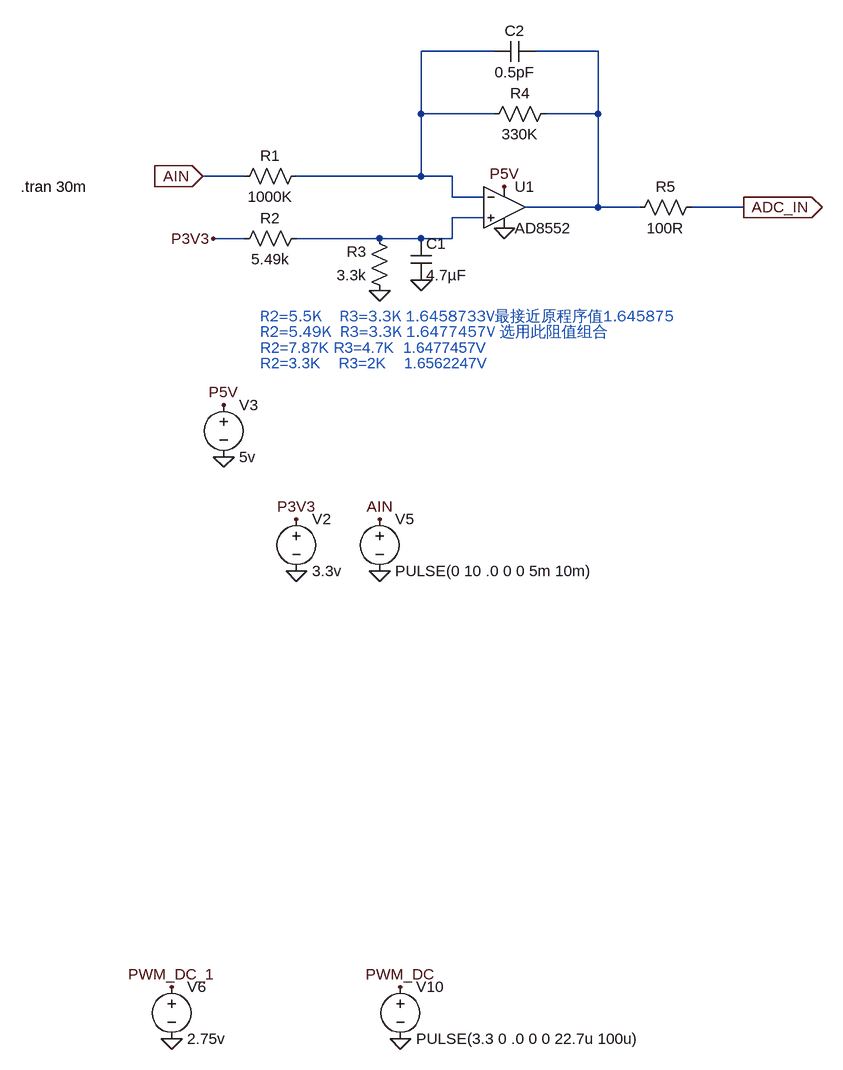
[diagram p0: schematic AD8551_修改为3.3V.asc]
AD8551_修改为3.3V.asc, the LTspice schematic file:
Version 4
SHEET 1 1680 1284
WIRE -608 -256 -720 -256
WIRE -448 -256 -544 -256
WIRE -720 -160 -720 -256
WIRE -608 -160 -720 -160
WIRE -448 -160 -448 -256
WIRE -448 -160 -528 -160
WIRE -992 -64 -1056 -64
WIRE -720 -64 -720 -160
WIRE -720 -64 -912 -64
WIRE -672 -64 -720 -64
WIRE -672 -32 -672 -64
WIRE -624 -32 -672 -32
WIRE -448 -16 -448 -160
WIRE -448 -16 -560 -16
WIRE -384 -16 -448 -16
WIRE -224 -16 -304 -16
WIRE -624 0 -672 0
WIRE -992 32 -1040 32
WIRE -784 32 -912 32
WIRE -720 32 -784 32
WIRE -672 32 -672 0
WIRE -672 32 -720 32
FLAG -912 544 0
FLAG -1024 368 0
FLAG -784 544 0
FLAG -1024 288 P5V
FLAG -752 1264 0
FLAG -752 1184 PWM_DC
FLAG -912 464 P3V3
FLAG -1104 1264 0
FLAG -1104 1184 PWM_DC_1
FLAG -224 -16 ADC_IN
IOPIN -224 -16 Out
FLAG -1056 -64 AIN
IOPIN -1056 -64 In
FLAG -1040 32 P3V3
FLAG -592 -48 P5V
FLAG -592 16 0
FLAG -784 112 0
FLAG -720 96 0
FLAG -784 464 AIN
SYMBOL voltage -912 448 R0
WINDOW 123 0 0 Left 0
WINDOW 39 0 0 Left 0
SYMATTR InstName V2
SYMATTR Value 3.3v
SYMBOL voltage -1024 272 R0
WINDOW 123 0 0 Left 0
WINDOW 39 0 0 Left 0
SYMATTR InstName V3
SYMATTR Value 5v
SYMBOL voltage -784 448 R0
WINDOW 123 0 0 Left 0
WINDOW 39 0 0 Left 0
SYMATTR InstName V5
SYMATTR Value PULSE(0 10 .0 0 0 5m 10m)
SYMBOL voltage -752 1168 R0
WINDOW 123 0 0 Left 0
WINDOW 39 0 0 Left 0
SYMATTR InstName V10
SYMATTR Value PULSE(3.3 0 .0 0 0 22.7u 100u)
SYMBOL voltage -1104 1168 R0
WINDOW 123 0 0 Left 0
WINDOW 39 0 0 Left 0
SYMATTR InstName V6
SYMATTR Value 2.75v
SYMBOL res -896 -80 R90
WINDOW 0 0 56 VBottom 2
WINDOW 3 32 56 VTop 2
SYMATTR InstName R1
SYMATTR Value 1000K
SYMBOL res -896 16 R90
WINDOW 0 0 56 VBottom 2
WINDOW 3 32 56 VTop 2
SYMATTR InstName R2
SYMATTR Value 5.49k
SYMBOL res -768 128 R180
WINDOW 0 36 76 Left 2
WINDOW 3 36 40 Left 2
SYMATTR InstName R3
SYMATTR Value 3.3k
SYMBOL res -624 -144 R270
WINDOW 0 32 56 VTop 2
WINDOW 3 0 56 VBottom 2
SYMATTR InstName R4
SYMATTR Value 330K
SYMBOL res -400 0 R270
WINDOW 0 32 56 VTop 2
WINDOW 3 0 56 VBottom 2
SYMATTR InstName R5
SYMATTR Value 100R
SYMBOL cap -736 32 R0
SYMATTR InstName C1
SYMATTR Value 4.7µF
SYMBOL cap -544 -272 R90
WINDOW 0 0 32 VBottom 2
WINDOW 3 32 32 VTop 2
SYMATTR InstName C2
SYMATTR Value 0.5pF
SYMBOL OpAmps\\AD8552 -592 -80 R0
SYMATTR InstName U1
TEXT -1336 -48 Left 2 !.tran 30m
TEXT -968 152 Left 2 ;R2=5.5K    R3=3.3K 1.6458733V最接近原程序值1.645875
TEXT -968 200 Left 2 ;R2=7.87K R3=4.7K  1.6477457V
TEXT -968 224 Left 2 ;R2=3.3K    R3=2K    1.6562247V
TEXT -968 176 Left 2 ;R2=5.49K  R3=3.3K 1.6477457V 选用此阻值组合

The netlist it stands for:
* AD8551_修改为3.3V.asc
V2 P3V3 0 3.3v
V3 P5V 0 5v
V5 AIN 0 PULSE(0 10 .0 0 0 5m 10m)
V10 PWM_DC 0 PULSE(3.3 0 .0 0 0 22.7u 100u)
V6 PWM_DC_1 0 2.75v
R1 N001 AIN 1000K
R2 N003 P3V3 5.49k
R3 0 N003 3.3k
R4 N001 N002 330K
R5 N002 ADC_IN 100R
C1 N003 0 4.7µF
C2 N002 N001 0.5pF
XU1 N003 N001 P5V 0 N002 AD8552  ; pins In+ In- V+ V- OUT
.tran 30m
* R2=5.5K    R3=3.3K 1.6458733V最接近原程序值1.645875
* R2=7.87K R3=4.7K  1.6477457V
* R2=3.3K    R3=2K    1.6562247V
* R2=5.49K  R3=3.3K 1.6477457V 选用此阻值组合
.backanno
.end